# EasyEDA Pro project ProPrj_BrainStimulator-4Channels-Prototype_2025-12-16.epro, schematic Main

## Sheets
1 Main: Board Name: Board1; Create Date: 2025-11-07; Page Name: P1; Project Name: BrainStimulator-4Channels-Prototype; Schematic Name: Schematic1; Update Date: 2025-11-07; Company: 嘉立创EDA; Page Size: A4; Version: V1.0
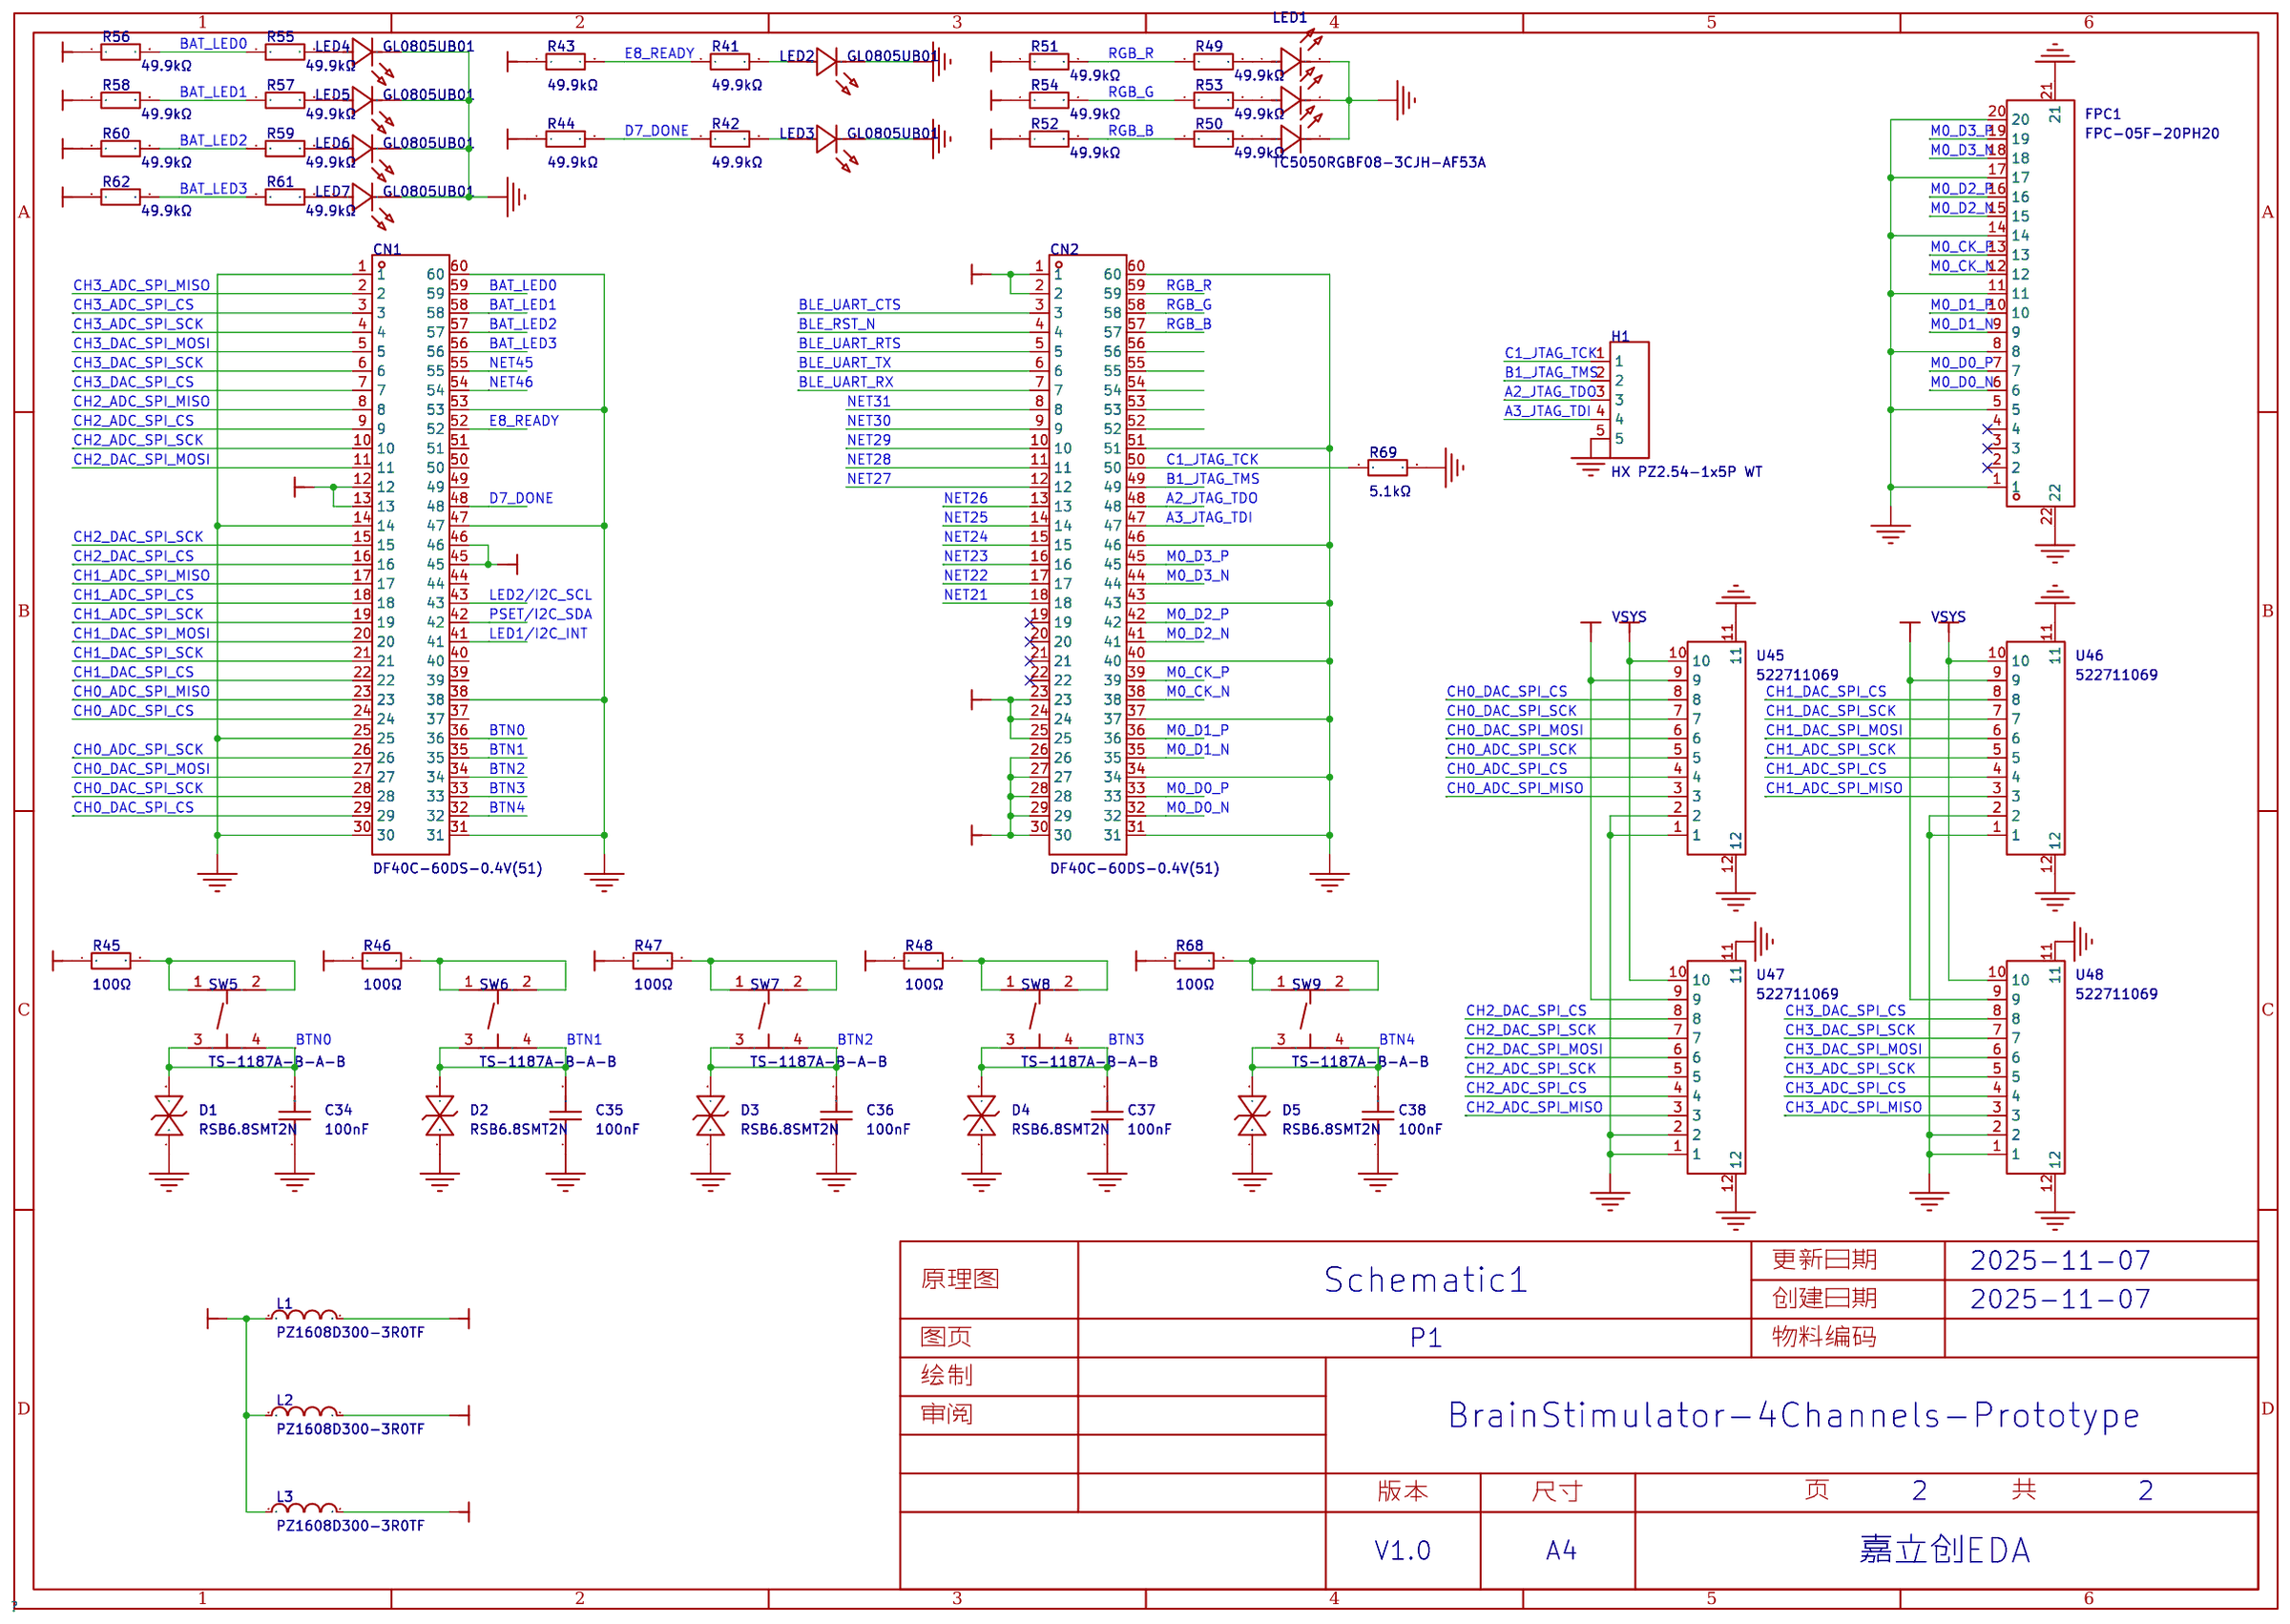
[diagram p2: Main]
2 Power
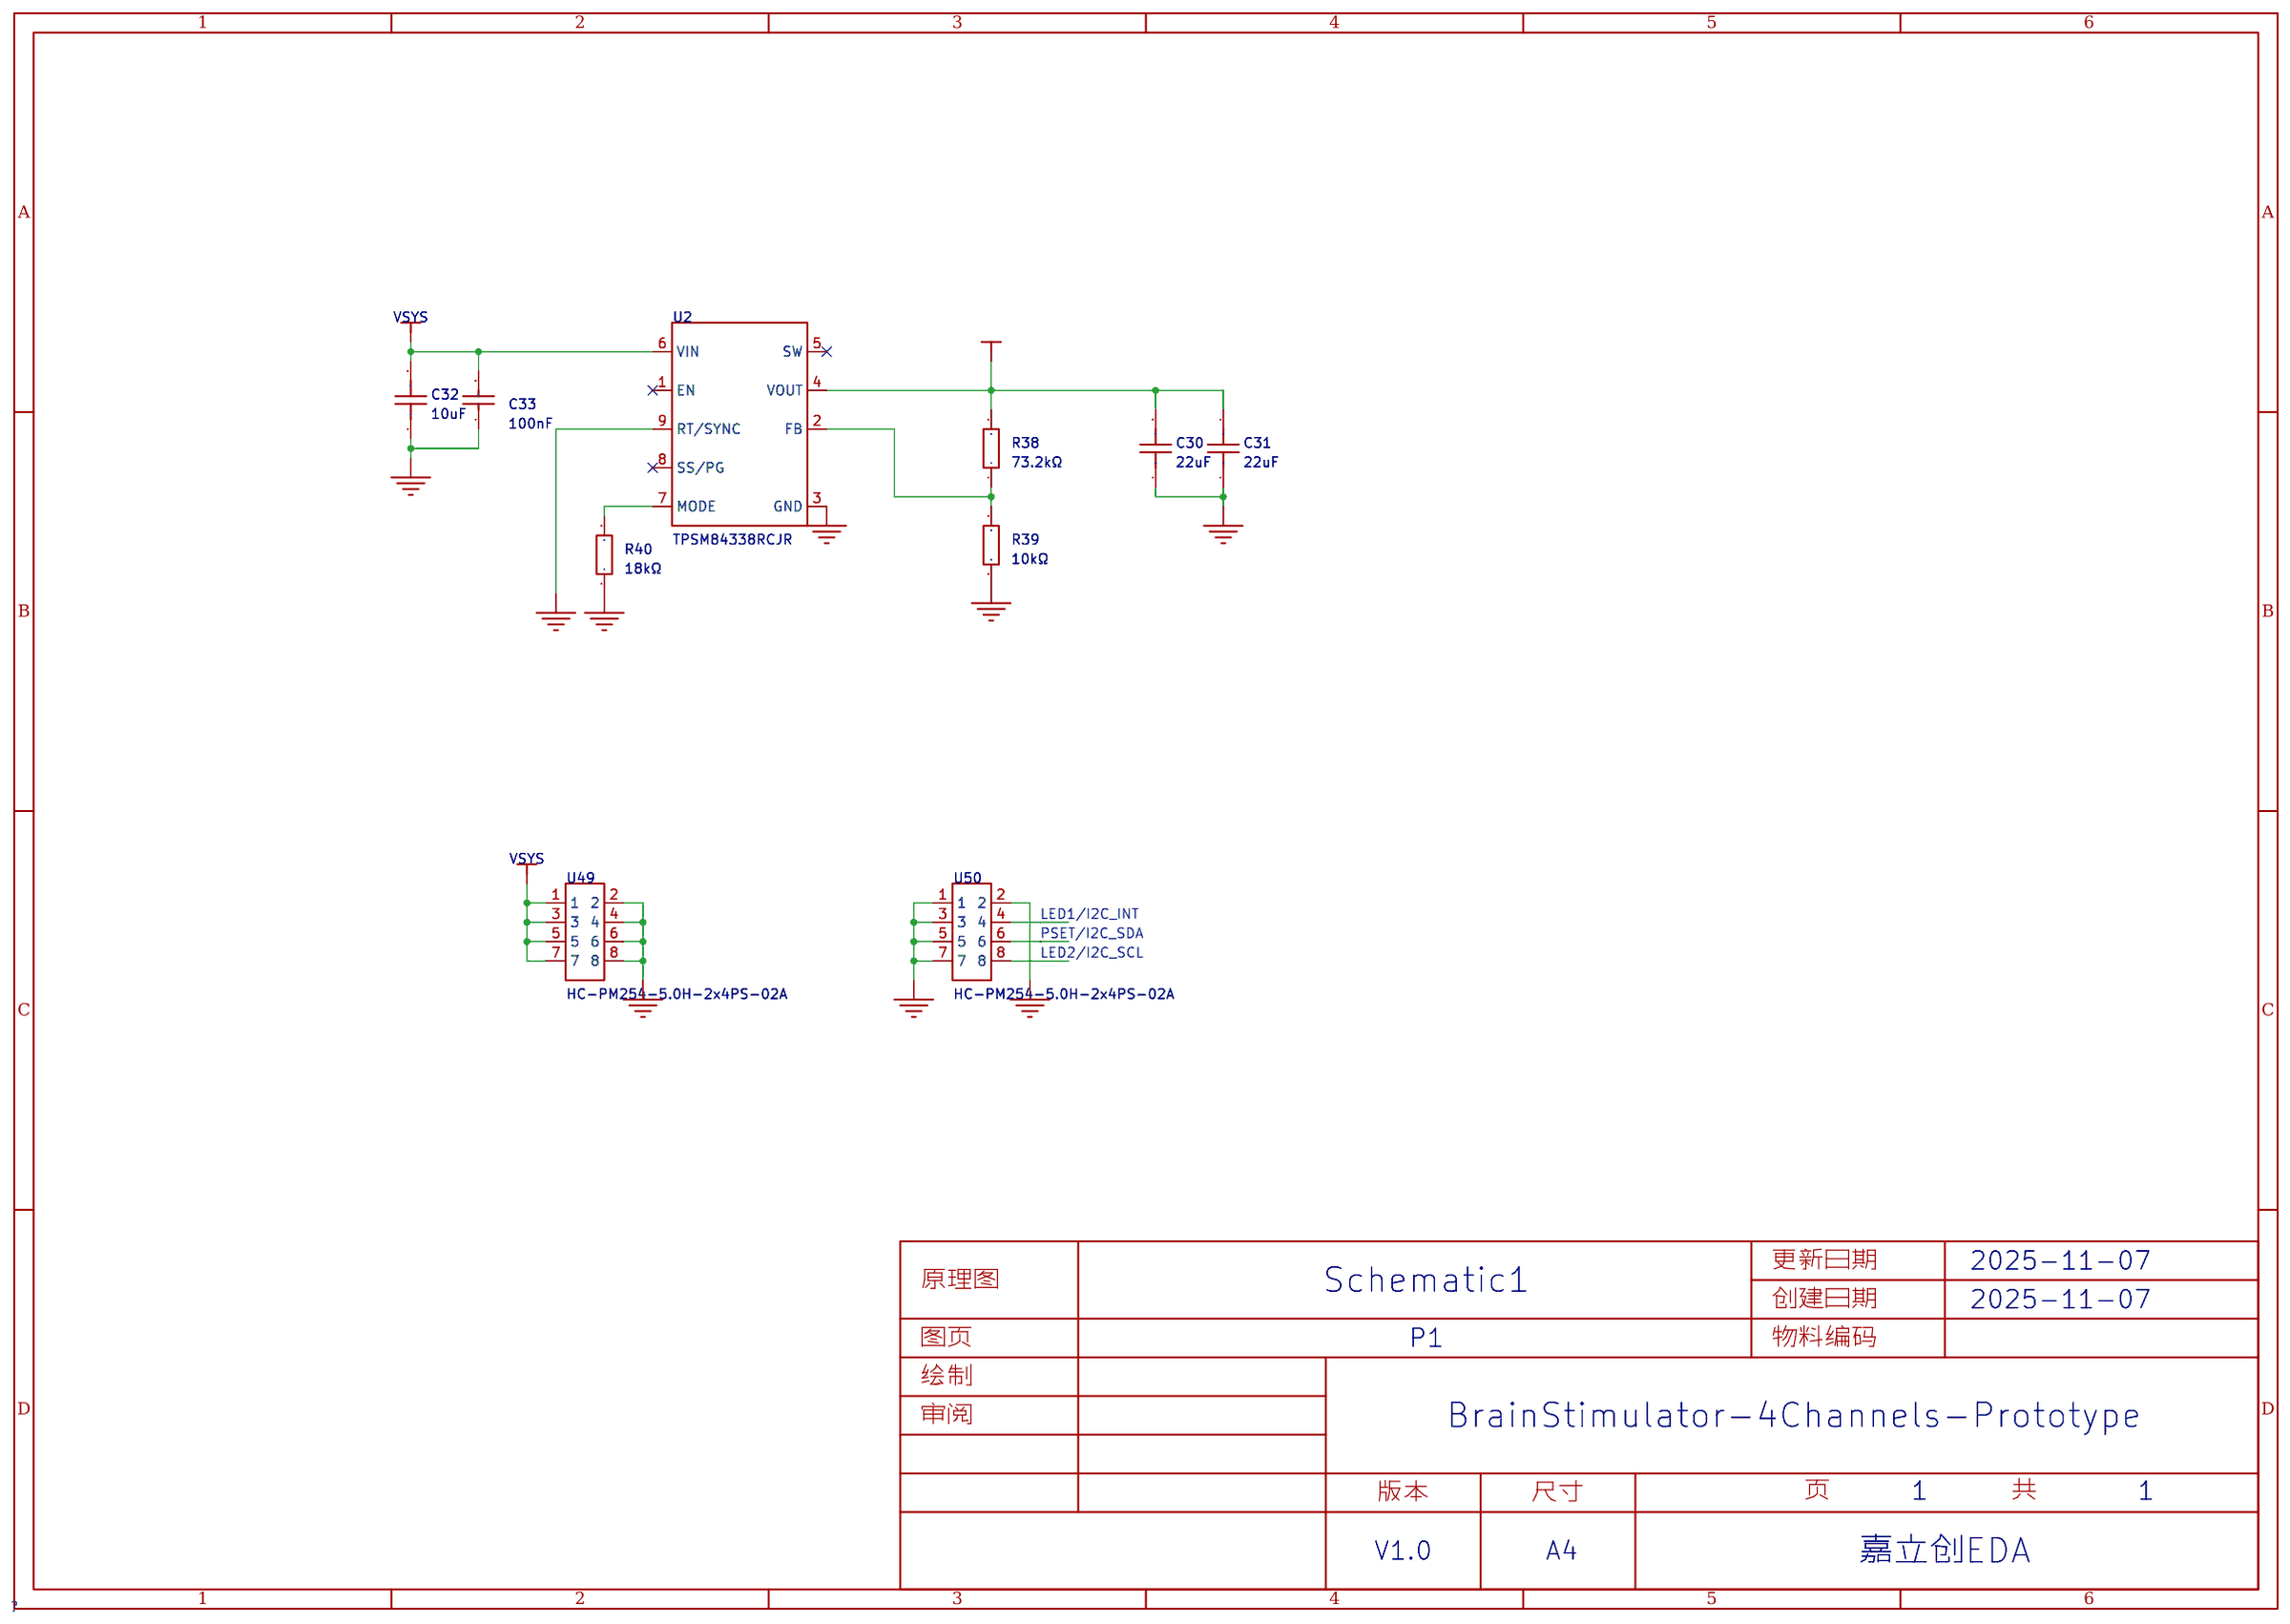
[diagram p3: Power]
3 Comm: Board Name: Cntrl Board; Create Date: 2025-11-16; Update Date: 2025-11-16
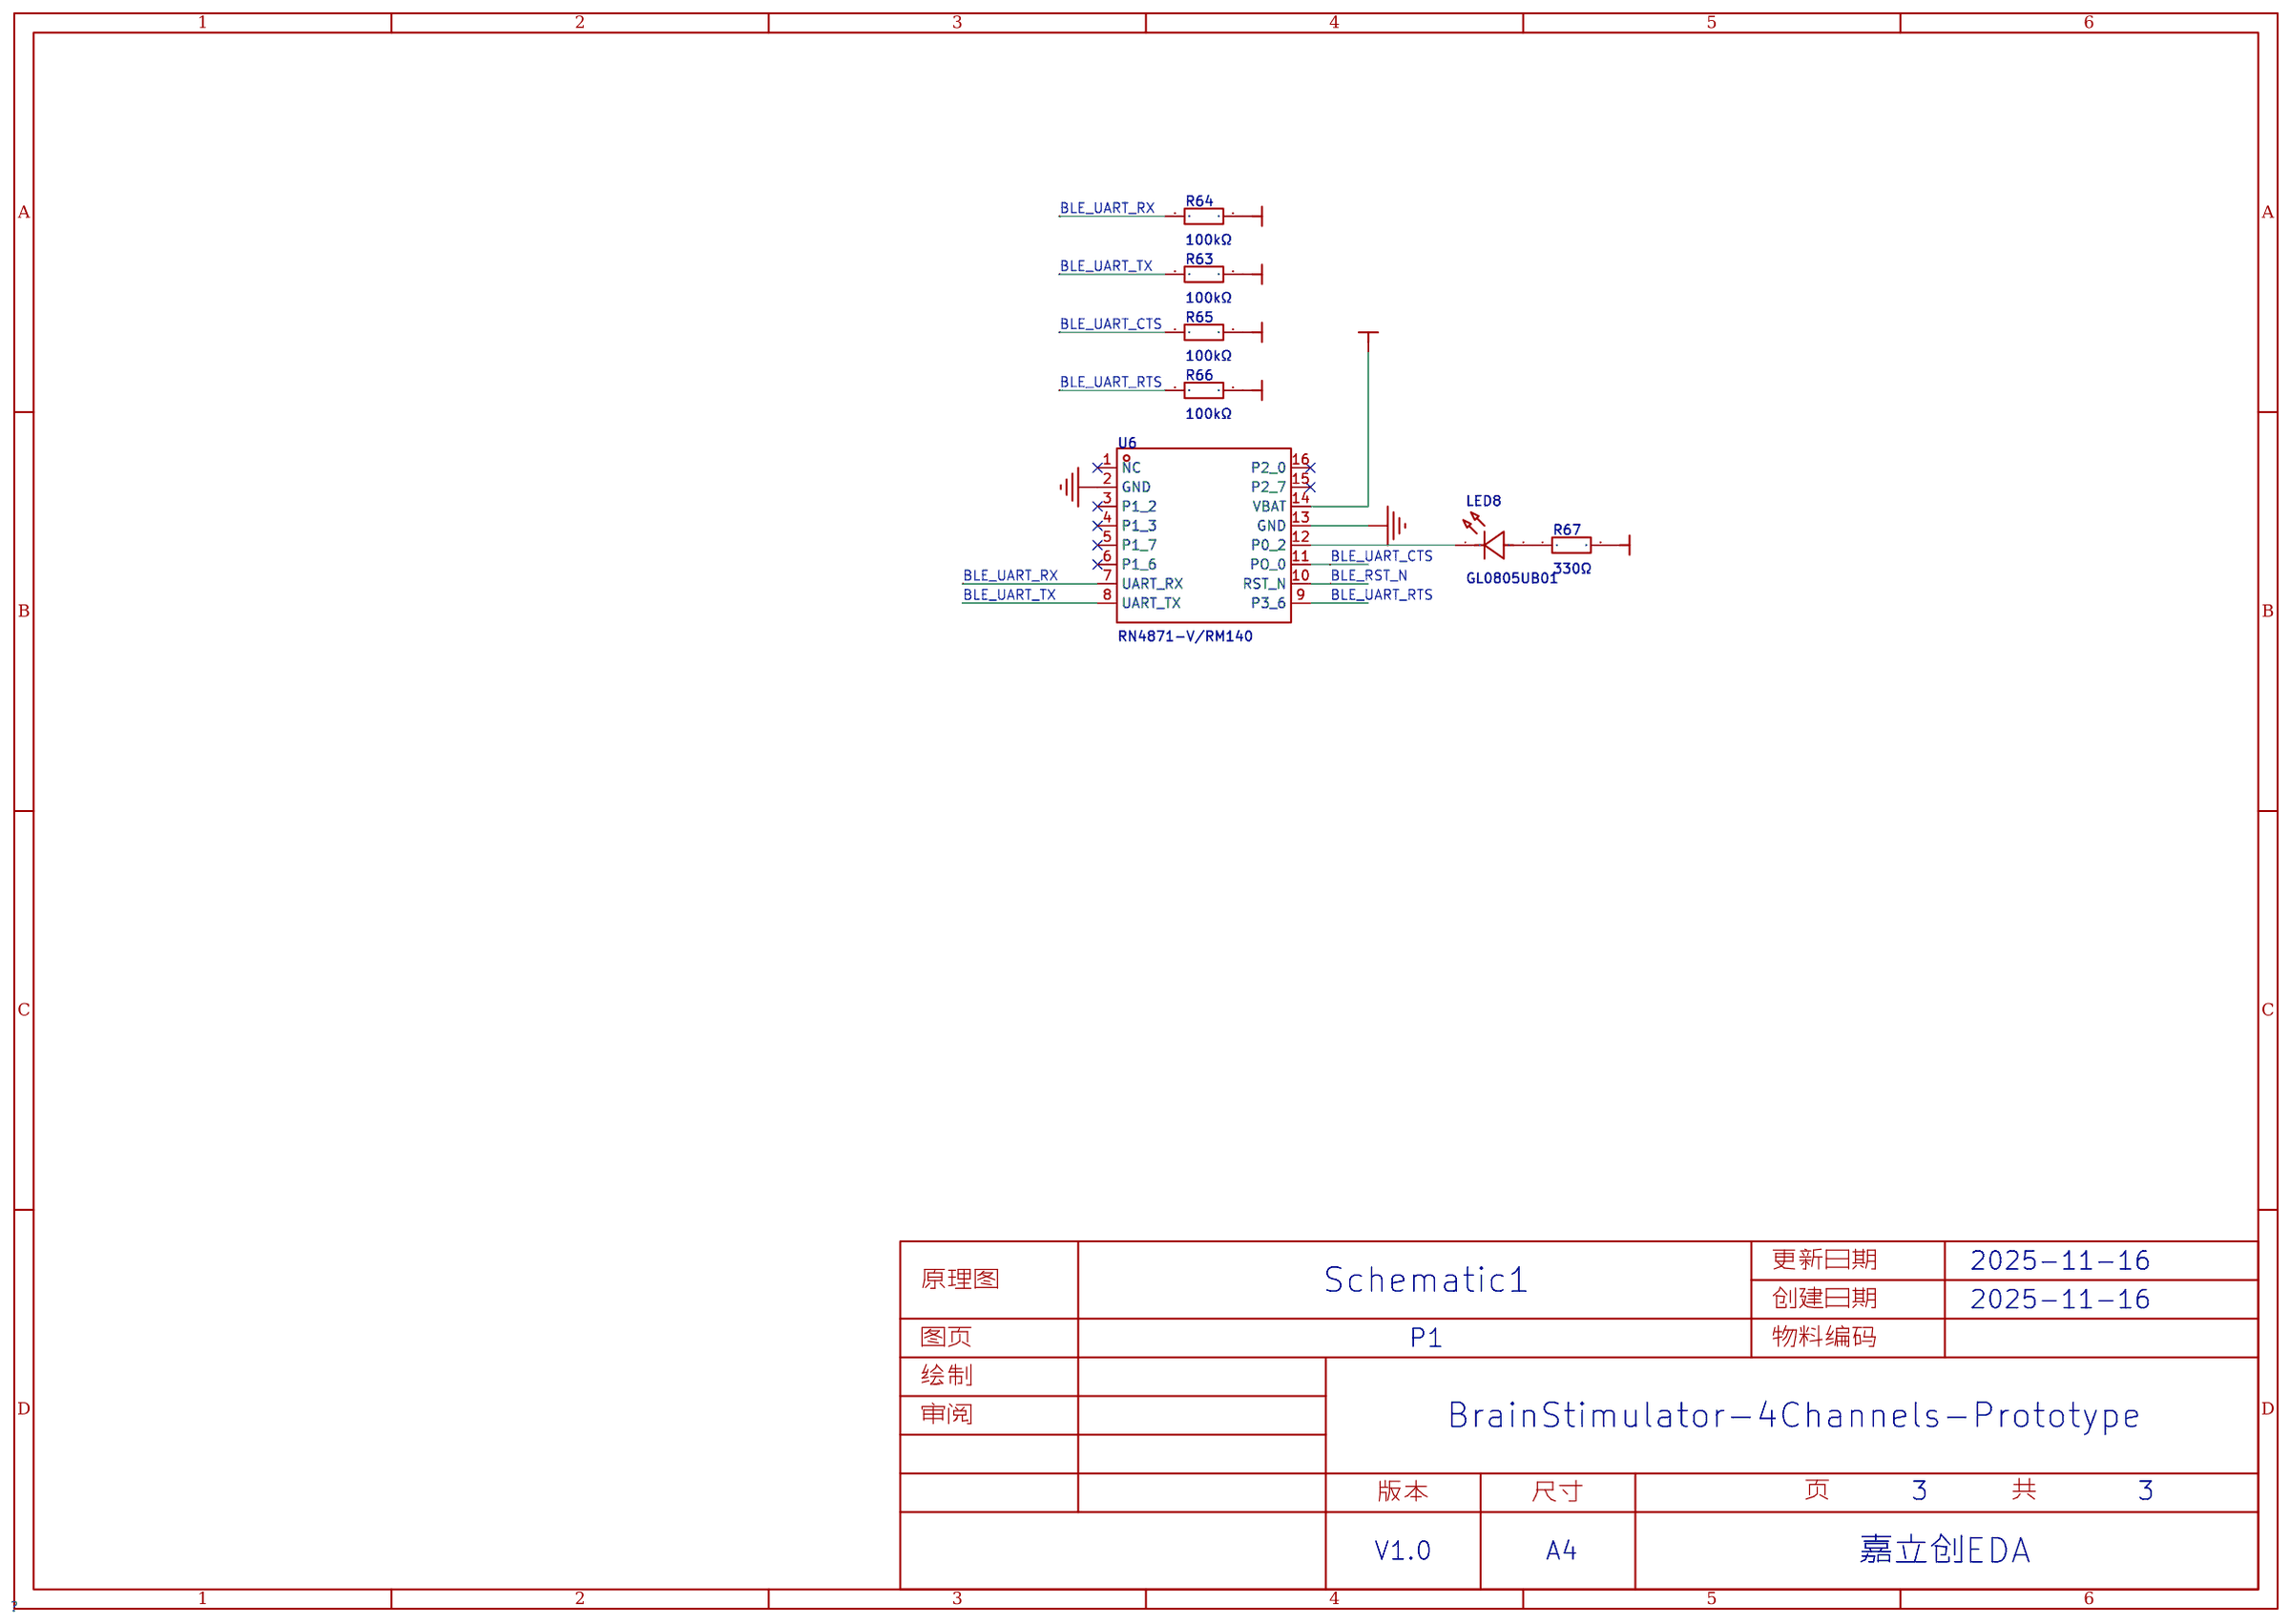
[diagram p4: Comm]

## Parts
sheet Comm
LED8  GL0805UB01  [LED0805-RD_BLUE]
R63  100kΩ  [R0603]
R64  100kΩ  [R0603]
R65  100kΩ  [R0603]
R66  100kΩ  [R0603]
R67  330Ω  [R0603]
U6  RN4871-V/RM140  [BULETM-SMD_RN4871-V-RM140]
sheet Main
C34  100nF  [C0603]
C35  100nF  [C0603]
C36  100nF  [C0603]
C37  100nF  [C0603]
C38  100nF  [C0603]
CN1  DF40C-60DS-0.4V(51)  [CONN-SMD_DF40C-60DS-0.4V-51]
CN2  DF40C-60DS-0.4V(51)  [CONN-SMD_DF40C-60DS-0.4V-51]
D1  RSB6.8SMT2N  [SOD-523_L1.2-W0.8-LS1.6-BI]
D2  RSB6.8SMT2N  [SOD-523_L1.2-W0.8-LS1.6-BI]
D3  RSB6.8SMT2N  [SOD-523_L1.2-W0.8-LS1.6-BI]
D4  RSB6.8SMT2N  [SOD-523_L1.2-W0.8-LS1.6-BI]
D5  RSB6.8SMT2N  [SOD-523_L1.2-W0.8-LS1.6-BI]
FPC1  FPC-05F-20PH20  [FPC-SMD_20P-P0.50_XUNPU_FPC-05F-20PH20]
H1  HX PZ2.54-1x5P WT  [HDR-SMD_5P-P2.54-H-M-W12.8-N]
L1  PZ1608D300-3R0TF  [L0603]
L2  PZ1608D300-3R0TF  [L0603]
L3  PZ1608D300-3R0TF  [L0603]
LED1  TC5050RGBF08-3CJH-AF53A  [LED-SMD_6P-L5.0-W5.0-TL_TC5050RGBF08]
LED2  GL0805UB01  [LED0805-RD_BLUE]
LED3  GL0805UB01  [LED0805-RD_BLUE]
LED4  GL0805UB01  [LED0805-RD_BLUE]
LED5  GL0805UB01  [LED0805-RD_BLUE]
LED6  GL0805UB01  [LED0805-RD_BLUE]
LED7  GL0805UB01  [LED0805-RD_BLUE]
R41  49.9kΩ  [R0603]
R42  49.9kΩ  [R0603]
R43  49.9kΩ  [R0603]
R44  49.9kΩ  [R0603]
R45  100Ω  [R0603]
R46  100Ω  [R0603]
R47  100Ω  [R0603]
R48  100Ω  [R0603]
R49  49.9kΩ  [R0603]
R50  49.9kΩ  [R0603]
R51  49.9kΩ  [R0603]
R52  49.9kΩ  [R0603]
R53  49.9kΩ  [R0603]
R54  49.9kΩ  [R0603]
R55  49.9kΩ  [R0603]
R56  49.9kΩ  [R0603]
R57  49.9kΩ  [R0603]
R58  49.9kΩ  [R0603]
R59  49.9kΩ  [R0603]
R60  49.9kΩ  [R0603]
R61  49.9kΩ  [R0603]
R62  49.9kΩ  [R0603]
R68  100Ω  [R0603]
R69  5.1kΩ  [R0603]
SW5  TS-1187A-B-A-B  [SW-SMD_4P-L5.1-W5.1-P3.70-LS6.5-TL_H1.5]
SW6  TS-1187A-B-A-B  [SW-SMD_4P-L5.1-W5.1-P3.70-LS6.5-TL_H1.5]
SW7  TS-1187A-B-A-B  [SW-SMD_4P-L5.1-W5.1-P3.70-LS6.5-TL_H1.5]
SW8  TS-1187A-B-A-B  [SW-SMD_4P-L5.1-W5.1-P3.70-LS6.5-TL_H1.5]
SW9  TS-1187A-B-A-B  [SW-SMD_4P-L5.1-W5.1-P3.70-LS6.5-TL_H1.5]
U45  522711069  [FPC-SMD_10P-P1.00_522711069]
U46  522711069  [FPC-SMD_10P-P1.00_522711069]
U47  522711069  [FPC-SMD_10P-P1.00_522711069]
U48  522711069  [FPC-SMD_10P-P1.00_522711069]
sheet Power
C30  22uF  [C0603]
C31  22uF  [C0603]
C32  10uF  [C0805]
C33  100nF  [C0805]
R38  73.2kΩ  [R0603]
R39  10kΩ  [R0603]
R40  18kΩ  [R0603]
U2  TPSM84338RCJR  [QFN-FCMOD-9_L4.5-W3.3_TPSM84338]
U49  HC-PM254-5.0H-2x4PS-02A  [HDR-SMD_8P-P2.54-V-F-R2-C4-S7.2-2]
U50  HC-PM254-5.0H-2x4PS-02A  [HDR-SMD_8P-P2.54-V-F-R2-C4-S7.2-2]

## Library data of the parts
LED2-LED8 = GL0805UB01: 0805 蓝灯 高亮; LCSC Part Name: 0805 蓝灯 高亮; Supplier Part: C51933309; Manufacturer: Guiguang light(桂光光电); Supplier Footprint: 0805; JLCPCB Part Class: Extended Part; Datasheet: https://item.szlcsc.com/datasheet/GL0805UB01/54646005.html; Supplier: LCSC
R63-R66 = RC0603FR-07100KL: 电阻类型:厚膜电阻;阻值:100kΩ;精度:±1%;功率:100mW;最大工作电压:75V;温度系数:±100ppm/℃;; LCSC Part Name: 厚膜电阻 100kΩ ±1% 100mW; Supplier Part: C14675; Manufacturer: YAGEO(国巨); Supplier Footprint: 0603; JLCPCB Part Class: Extended Part; Datasheet: https://atta.szlcsc.com/upload/public/pdf/source/20140324/1457707028752.pdf; Supplier: LCSC; Type: 厚膜电阻; Tolerance: ±1%; Power(Watts): 100mW; Overload Voltage (Max): 75V; Temperature Coefficient: ±100ppm/℃; Operating Temperature Range: -55℃~+155℃
R67 = RC0603FR-07330RL: 电阻类型:厚膜电阻;阻值:330Ω;精度:±1%;功率:100mW;最大工作电压:75V;温度系数:±100ppm/℃;; LCSC Part Name: 厚膜电阻 330Ω ±1% 100mW; Supplier Part: C105881; Manufacturer: YAGEO(国巨); Supplier Footprint: 0603; JLCPCB Part Class: Extended Part; Datasheet: https://atta.szlcsc.com/upload/public/pdf/source/20180821/C275644_0D56F95EFF785E7D9A1FEF436B37DA78.pdf; Supplier: LCSC; Type: 厚膜电阻; Tolerance: ±1%; Power(Watts): 100mW; Overload Voltage (Max): 75V; Temperature Coefficient: ±100ppm/℃; Operating Temperature Range: -55℃~+155℃
U6 = RN4871-V/RM140: 核心芯片:RN4871芯片;支持接口:I2C；AIO；UART；SPI；PWM；PIO;最大发射功率:0dBm;; Supplier Part: C1137511; Manufacturer: MICROCHIP(美国微芯); Supplier Footprint: SMD-16P; JLCPCB Part Class: Extended Part; Datasheet: https://atta.szlcsc.com/upload/public/pdf/source/20230907/0BE14DED8745D173EF6797ADB81DCDC8.pdf; Supplier: LCSC; Core  IC: RN4871芯片; Support Interface: I2C；AIO；UART；SPI；PWM；PIO; Output Power  (Max): 0dBm
C34-C38 = CC0603KRX7R9BB104: 容值:100nF;精度:±10%;额定电压:50V;温度系数:X7R;; LCSC Part Name: 100nF ±10% 50V; Supplier Part: C14663; Manufacturer: YAGEO(国巨); Supplier Footprint: 0603; JLCPCB Part Class: Basic Part; Datasheet: https://item.szlcsc.com/datasheet/CC0603KRX7R9BB104/15331.html; Supplier: LCSC; Tolerance: ±10%; Voltage Rating: 50V; Temperature Coefficient: X7R
CN1 CN2 = DF40C-60DS-0.4V(51): PIN总数:-;间距:0.4mm;安装方式:立贴;行数:2;额定电流:300mA;工作温度范围:-35℃~+85℃;; LCSC Part Name: 间距:0.4mm 母 立贴; Supplier Part: C597938; Manufacturer: HRS(广濑); Supplier Footprint: SMD,P=0.4mm; JLCPCB Part Class: Extended Part; Datasheet: https://atta.szlcsc.com/upload/public/pdf/source/20200611/C597932_F50447A8BD413549CB06DCD4A9C7496A.pdf; Supplier: LCSC; Pitch: 0.4mm; Mounting Style: 立贴; Number of Rows: 2; Current Rating (Max): 300mA; Contact Plating: 金; Operating Temperature Range: -35℃~+85℃
D1-D5 = RSB6.8SMT2N: 极性:双向;击穿电压:5.78V;; LCSC Part Name: 双向ESD; Supplier Part: C510343; Manufacturer: ROHM(罗姆); Supplier Footprint: SOD-523; JLCPCB Part Class: Extended Part; Datasheet: https://item.szlcsc.com/datasheet/RSB6.8SMT2N/524160.html; Supplier: LCSC; Polarity: 双向; Voltage - Breakdown: 5.78V; Reverse Leakage Current (Ir): 500nA; Number of Channels: 单路; Type: ESD; Junction Capacitance: 30pF
FPC1 = FPC-05F-20PH20: 锁定特性:翻盖式;触点类型:卧贴;触点数量:20P;间距:0.5mm;安装方式:下接;工作温度:-25℃~+85℃;; LCSC Part Name: 翻盖式 卧贴 P数:20P 间距:0.5mm; Supplier Part: C2856803; Manufacturer: XUNPU(讯普); Supplier Footprint: SMD,P=0.5mm,卧贴; JLCPCB Part Class: Extended Part; Datasheet: https://item.szlcsc.com/datasheet/FPC-05F-20PH20/3056901.html; Supplier: LCSC; Locking Feature: 翻盖式; Contact Type: 卧贴; Number of Contacts: 20P; Pitch: 0.5mm; Mounting Type: 下接; FFC, FCB Thickness: 0.3mm; Height Above Board: 2mm; Contact Material: 磷青铜; Contact Plating: 锡; Operating Temperature: -25℃~+85℃; Rated Voltage (Max): 50V; Current Rating (Max): 500mA
H1 = HX PZ2.54-1x5P WT: 插针结构:1x5P;间距:2.54mm;行距:-;圆针/方针:方针;安装方式:卧贴;排数:单排;总PIN位数:5P;额定电流:3A;额定电压:1kV;配合针长度:6mm;塑高:2.5mm;端接针长度:-;触头材质:黄铜;触头镀层:金;工作温度:-40℃~+105℃;颜色:黑色;; LCSC Part Name: 配套排母：HX PM2.54-1x5P系列 1x5P 间距:2.54mm 方针 卧贴; Supplier Part: C46061678; Manufacturer: hanxia(韩下); Supplier Footprint: SMD,P=2.54mm,卧贴; JLCPCB Part Class: Extended Part; Datasheet: https://item.szlcsc.com/datasheet/HX%2520PZ2.54-1x5P%2520WT/48170538.html; Supplier: LCSC; Pin Structure: 1x5P; Pitch: 2.54mm; Circluar Pins/Square Pins: 方针; Mounting Type: 卧贴; Number of Rows: 单排; Number of Pins: 5P; Current Rating: 3A; Voltage Rating (Max): 1kV; Length of Mating Pin: 6mm; Insulation Height: 2.5mm; Contact Material: 黄铜; Contact Plating: 金; Operating Temperature: -40℃~+105℃; Color: 黑色
L1-L3 = PZ1608D300-3R0TF: 阻抗 @ 频率:30Ω@100MHz;误差:±25%;直流电阻(DCR):30mΩ;; LCSC Part Name: 单路 0603磁珠 阻抗30Ω@100MHz; Supplier Part: C145059; Manufacturer: Sunlord(顺络); Supplier Footprint: 0603; JLCPCB Part Class: Extended Part; Datasheet: https://atta.szlcsc.com/upload/public/pdf/source/20241120/56CFDC78F74CEDC225A629A43232883A.pdf; Supplier: LCSC; Impedance @ Frequency: 30Ω@100MHz; Tolerance: ±25%; DC Resistance: 30mΩ; Current Rating: 3A; Circuits: 1
LED1 = TC5050RGBF08-3CJH-AF53A: 5050RGB，0.2W 20mA; LCSC Part Name: RGB三色; Supplier Part: C784540; Manufacturer: TCWIN(天成); Supplier Footprint: SMD5050-6P; JLCPCB Part Class: Extended Part; Datasheet: https://item.szlcsc.com/datasheet/TC5050RGBF08-3CJH-AF53A/839886.html; Supplier: LCSC; Operating Temperature: -40℃~+85℃
R41-R44 R49-R62 = RC0603FR-0749K9L: 电阻类型:厚膜电阻;阻值:49.9kΩ;精度:±1%;功率:100mW;工作电压:75V;温度系数:±100ppm/℃;; LCSC Part Name: 厚膜电阻 49.9kΩ ±1% 100mW; Supplier Part: C114624; Manufacturer: YAGEO(国巨); Supplier Footprint: 0603; JLCPCB Part Class: Extended Part; Datasheet: https://item.szlcsc.com/datasheet/RC0603FR-0749K9L/115868.html; Supplier: LCSC; Type: 厚膜电阻; Tolerance: ±1%; Power(Watts): 100mW; Voltage-Supply(Max): 75V; Temperature Coefficient: ±100ppm/℃; Operating Temperature: -55℃~+155℃
R45-R48 R68 = RC0603FR-07100RL: 电阻类型:厚膜电阻;阻值:100Ω;精度:±1%;功率:100mW;最大工作电压:75V;温度系数:±100ppm/℃;; LCSC Part Name: 厚膜电阻 100Ω ±1% 100mW; Supplier Part: C105588; Manufacturer: YAGEO(国巨); Supplier Footprint: 0603; JLCPCB Part Class: Extended Part; Datasheet: https://atta.szlcsc.com/upload/public/pdf/source/20180316/70C0E2BDAE7FCC62C531A5A58D202EE1.pdf; Supplier: LCSC; Type: 厚膜电阻; Tolerance: ±1%; Power(Watts): 100mW; Overload Voltage (Max): 75V; Temperature Coefficient: ±100ppm/℃; Operating Temperature Range: -55℃~+155℃
R69 = RC0603FR-075K1L: 电阻类型:厚膜电阻;阻值:5.1kΩ;精度:±1%;功率:100mW;工作电压:75V;温度系数:±100ppm/℃;; LCSC Part Name: 厚膜电阻 5.1kΩ ±1% 100mW; Supplier Part: C105580; Manufacturer: YAGEO(国巨); Supplier Footprint: 0603; JLCPCB Part Class: Extended Part; Datasheet: https://item.szlcsc.com/datasheet/RC0603FR-075K1L/106795.html; Supplier: LCSC; Type: 厚膜电阻; Tolerance: ±1%; Power(Watts): 100mW; Voltage-Supply(Max): 75V; Temperature Coefficient: ±100ppm/℃; Operating Temperature: -55℃~+155℃
SW5-SW9 = TS-1187A-B-A-B: 电路结构:单刀单掷;按钮形状:圆形按钮;作用力:1.6N;安装方式:立贴;开关长度:5.1mm;开关宽度:5.1mm;开关高度:1.5mm;带支架:不带支架;触点电流:50mA;额定电压:12V;带灯:无;工作寿命:10万次;; LCSC Part Name: 5.1*5.1*1.5mm 立贴 轻触开关; Supplier Part: C318884; Manufacturer: XKB Connection(中国星坤); Supplier Footprint: SMD; JLCPCB Part Class: Basic Part; Datasheet: https://item.szlcsc.com/datasheet/TS-1187A-B-A-B/299976.html; Supplier: LCSC; Circuit: 单刀单掷; Actuator Style: 圆形按钮; Operating Force: 1.6N; Mounting Type: 立贴; Length: 5.1mm; Width: 5.1mm; Switch Height: 1.5mm; with Bracket: 不带支架; Contact Current: 50mA; Voltage Rating: 12V; Actuator/Cap Color: 金色; With Lamp: 无; Life: 10万次; Operating Temperature: -30℃~+85℃
U45-U48 = 522711069: 触点类型:下接;触点数量:10P;间距:1mm;工作温度:-40℃~+85℃;; LCSC Part Name: 下接 P数:10P 间距:1mm; Supplier Part: C588180; Manufacturer: MOLEX; Supplier Footprint: SMD,P=1mm; JLCPCB Part Class: Extended Part; Datasheet: https://www.molex.com/content/dam/molex/molex-dot-com/products/automated/en-us/salesdrawingpdf/522/52271/522711069_sd.pdf?inline\; Supplier: LCSC; Contact Type: 下接; Number of Contacts: 10P; Pitch: 1mm; Contact Material: 磷青铜; Contact Plating: 金; Operating Temperature: -40℃~+85℃; Rated Voltage (Max): 50V; Current Rating (Max): 500mA
C30 C31 = CL10A226MP8NUNE: 容值:22uF;精度:±20%;额定电压:10V;温度系数:X5R;; LCSC Part Name: 22uF ±20% 10V; Supplier Part: C86295; Manufacturer: SAMSUNG(三星); Supplier Footprint: 0603; JLCPCB Part Class: Extended Part; Datasheet: https://item.szlcsc.com/datasheet/CL10A226MP8NUNE/87471.html; Supplier: LCSC; Tolerance: ±20%; Voltage Rating: 10V; Temperature Coefficient: X5R
C32 = GRM21BR61H106KE43L: 容值:10uF;精度:±10%;额定电压:50V;温度系数:X5R;; LCSC Part Name: 10uF ±10% 50V; Supplier Part: C440198; Manufacturer: muRata(村田); Supplier Footprint: 0805; JLCPCB Part Class: Basic Part; Datasheet: https://item.szlcsc.com/datasheet/GRM21BR61H106KE43L/439567.html; Supplier: LCSC; Tolerance: ±10%; Voltage Rating: 50V; Temperature Coefficient: X5R
C33 = CL21B104KBCNNNC: 容值:100nF;精度:±10%;额定电压:50V;温度系数:X7R;; LCSC Part Name: 100nF ±10% 50V; Supplier Part: C1711; Manufacturer: SAMSUNG(三星); Supplier Footprint: 0805; JLCPCB Part Class: Extended Part; Datasheet: https://item.szlcsc.com/datasheet/CL21B104KBCNNNC/2063.html; Supplier: LCSC; Tolerance: ±10%; Voltage Rating: 50V; Temperature Coefficient: X7R
R38 = RC0603FR-0773K2L: 电阻类型:厚膜电阻;阻值:73.2kΩ;精度:±1%;功率:100mW;最大工作电压:75V;温度系数:±100ppm/℃;; LCSC Part Name: 厚膜电阻 73.2kΩ ±1% 100mW; Supplier Part: C163420; Manufacturer: YAGEO(国巨); Supplier Footprint: 0603; JLCPCB Part Class: Extended Part; Datasheet: https://atta.szlcsc.com/upload/public/pdf/source/20181009/C309620_DA5935B6E1D48212CB7A533FE518B3C2.pdf; Supplier: LCSC; Type: 厚膜电阻; Tolerance: ±1%; Power(Watts): 100mW; Overload Voltage (Max): 75V; Temperature Coefficient: ±100ppm/℃; Operating Temperature Range: -55℃~+155℃
R39 = RC0603FR-0710KL: 电阻类型:厚膜电阻;阻值:10kΩ;精度:±1%;功率:100mW;最大工作电压:75V;温度系数:±100ppm/℃;; LCSC Part Name: 厚膜电阻 10kΩ ±1% 100mW; Supplier Part: C98220; Manufacturer: YAGEO(国巨); Supplier Footprint: 0603; JLCPCB Part Class: Extended Part; Datasheet: https://atta.szlcsc.com/upload/public/pdf/source/20180927/C295883_E8D83085EA81BD7DE0B2B681138C15EE.pdf; Supplier: LCSC; Type: 厚膜电阻; Tolerance: ±1%; Power(Watts): 100mW; Overload Voltage (Max): 75V; Temperature Coefficient: ±100ppm/℃; Operating Temperature Range: -55℃~+155℃
R40 = RC0603FR-0718KL: 电阻类型:厚膜电阻;阻值:18kΩ;精度:±1%;功率:100mW;工作电压:75V;温度系数:±100ppm/℃;; LCSC Part Name: 厚膜电阻 18kΩ ±1% 100mW; Supplier Part: C114610; Manufacturer: YAGEO(国巨); Supplier Footprint: 0603; JLCPCB Part Class: Extended Part; Datasheet: https://item.szlcsc.com/datasheet/RC0603FR-0718KL/115854.html; Supplier: LCSC; Type: 厚膜电阻; Tolerance: ±1%; Power(Watts): 100mW; Voltage-Supply(Max): 75V; Temperature Coefficient: ±100ppm/℃; Operating Temperature: -55℃~+155℃
U2 = TPSM84338RCJR_C47122151: 是一种高效、高电压输入、易于使用的同步降压电源模块，具有高度的设计灵活性。其工作输入电压范围为3.8V至28V，适用于由5V、12V、19V、24V电源总线轨供电的系统。该设备支持高达3A的连续输出电流和98%的最大占空比。使用带内部补偿的固定频率峰值电流控制，以实现快速瞬态响应和良好的线路及负载调节; Supplier Part: C47122151; Manufacturer: TI(德州仪器); Supplier Footprint: QFN-FCMOD-9; JLCPCB Part Class: Extended Part; Datasheet: https://www.ti.com.cn/cn/lit/ds/symlink/tpsm84338.pdf; Supplier: LCSC
U49 U50 = HC-PM254-5.0H-2x4PS-02A: 插孔结构:2x4P;间距:2.54mm;行距:2.54mm;圆孔/方孔:方孔;安装方式:立贴;排数:双排;总孔位数:8P;额定电流:3A;额定电压:-;插孔方向:顶部;塑高:5mm;触头材质:黄铜;触头镀层:金;工作温度:-40℃~+105℃;; LCSC Part Name: 间距2.54mm 2x4Pin 立贴 PW7.4 H5.0; Supplier Part: C42163132; Manufacturer: HC(虹成电子); Supplier Footprint: SMD,P=2.54mm; JLCPCB Part Class: Extended Part; Datasheet: https://item.szlcsc.com/datasheet/HC-PM254-5.0H-2x4PS-02A/44033121.html; Supplier: LCSC; Holes Structure: 2x4P; Pitch: 2.54mm; Row Spacing: 2.54mm; Circular Hole / Square Hole: 方孔; Mounting Type: 立贴; Number of Rows: 双排; Number of Positions: 8P; Current Rating: 3A; Holes Direction: 顶部; Insulation Height: 5mm; Contact Material: 黄铜; Contact Plating: 金; Operating Temperature: -40℃~+105℃

## Nets
3V3: CN2.23 CN2.24 CN2.25 L1.1 L2.1 L3.1 R43.1 R44.1 R45.1 R46.1 R47.1 R48.1 R51.1 R52.1 R54.1 R56.1 R58.1 R60.1 R62.1 R63.1 R64.1 R65.1 R66.1 R67.2 R68.1 U6.14(VBAT) U45.9 U46.9 U47.9 U48.9
+5V: C30.2 C31.2 CN2.26 CN2.27 CN2.28 CN2.29 CN2.30 R38.2 U2.4(VOUT)
GND: C30.1 C31.1 C32.1 C33.1 C34.1 C35.1 C36.1 C37.1 C38.1 CN1.1 CN1.14 CN1.25 CN1.30 CN1.31 CN1.38 CN1.47 CN1.53 CN1.60 CN2.31 CN2.34 CN2.37 CN2.40 CN2.43 CN2.46 CN2.51 CN2.60 D1.1(C) D2.1(C) D3.1(C) D4.1(C) D5.1(C) FPC1.1 FPC1.5 FPC1.8 FPC1.11 FPC1.14 FPC1.17 FPC1.20 FPC1.21 FPC1.22 H1.5 LED1.4(-) LED1.5(-) LED1.6(-) LED2.1(K) LED3.1(K) LED4.1(K) LED5.1(K) LED6.1(K) LED7.1(K) R39.1 R40.1 R69.2 U2.3(GND) U2.9(RT/SYNC) U6.2(GND) U6.13(GND) U45.1 U45.2 U45.11 U45.12 U46.1 U46.2 U46.11 U46.12 U47.1 U47.2 U47.11 U47.12 U48.1 U48.2 U48.11 U48.12 U49.2 U49.4 U49.6 U49.8 U50.1 U50.2 U50.3 U50.5 U50.7
A2_JTAG_TDO: CN2.48 H1.3
A3_JTAG_TDI: CN2.47 H1.4
B1_JTAG_TMS: CN2.49 H1.2
BAT_LED0: CN1.59 R55.1 R56.2
BAT_LED1: CN1.58 R57.1 R58.2
BAT_LED2: CN1.57 R59.1 R60.2
BAT_LED3: CN1.56 R61.1 R62.2
BLE_RST_N: CN2.4 U6.10(RST_N)
BLE_UART_CTS: CN2.3 R65.2 U6.11(PO_0)
BLE_UART_RTS: CN2.5 R66.2 U6.9(P3_6)
BLE_UART_RX: CN2.7 R64.2 U6.7(UART_RX)
BLE_UART_TX: CN2.6 R63.2 U6.8(UART_TX)
BTN0: C34.2 CN1.36 D1.2(A) SW5.3(C) SW5.4(D)
BTN1: C35.2 CN1.35 D2.2(A) SW6.3(C) SW6.4(D)
BTN2: C36.2 CN1.34 D3.2(A) SW7.3(C) SW7.4(D)
BTN3: C37.2 CN1.33 D4.2(A) SW8.3(C) SW8.4(D)
BTN4: C38.2 CN1.32 D5.2(A) SW9.3(C) SW9.4(D)
C1_JTAG_TCK: CN2.50 H1.1 R69.1
CH0_ADC_SPI_CS: CN1.24 U45.4
CH0_ADC_SPI_MISO: CN1.23 U45.3
CH0_ADC_SPI_SCK: CN1.26 U45.5
CH0_DAC_SPI_CS: CN1.29 U45.8
CH0_DAC_SPI_MOSI: CN1.27 U45.6
CH0_DAC_SPI_SCK: CN1.28 U45.7
CH1_ADC_SPI_CS: CN1.18 U46.4
CH1_ADC_SPI_MISO: CN1.17 U46.3
CH1_ADC_SPI_SCK: CN1.19 U46.5
CH1_DAC_SPI_CS: CN1.22 U46.8
CH1_DAC_SPI_MOSI: CN1.20 U46.6
CH1_DAC_SPI_SCK: CN1.21 U46.7
CH2_ADC_SPI_CS: CN1.9 U47.4
CH2_ADC_SPI_MISO: CN1.8 U47.3
CH2_ADC_SPI_SCK: CN1.10 U47.5
CH2_DAC_SPI_CS: CN1.16 U47.8
CH2_DAC_SPI_MOSI: CN1.11 U47.6
CH2_DAC_SPI_SCK: CN1.15 U47.7
CH3_ADC_SPI_CS: CN1.3 U48.4
CH3_ADC_SPI_MISO: CN1.2 U48.3
CH3_ADC_SPI_SCK: CN1.4 U48.5
CH3_DAC_SPI_CS: CN1.7 U48.8
CH3_DAC_SPI_MOSI: CN1.5 U48.6
CH3_DAC_SPI_SCK: CN1.6 U48.7
D7_DONE: CN1.48 R42.1 R44.2
E8_READY: CN1.52 R41.1 R43.2
LED1/I2C_INT: CN1.41 U50.4
LED2/I2C_SCL: CN1.43 U50.8
M0_CK_N: CN2.38 FPC1.12
M0_CK_P: CN2.39 FPC1.13
M0_D0_N: CN2.32 FPC1.6
M0_D0_P: CN2.33 FPC1.7
M0_D1_N: CN2.35 FPC1.9
M0_D1_P: CN2.36 FPC1.10
M0_D2_N: CN2.41 FPC1.15
M0_D2_P: CN2.42 FPC1.16
M0_D3_N: CN2.44 FPC1.18
M0_D3_P: CN2.45 FPC1.19
NET21: CN2.18
NET22: CN2.17
NET23: CN2.16
NET24: CN2.15
NET25: CN2.14
NET26: CN2.13
NET27: CN2.12
NET28: CN2.11
NET29: CN2.10
NET30: CN2.9
NET31: CN2.8
NET45: CN1.55
NET46: CN1.54
PSET/I2C_SDA: CN1.42 U50.6
RGB_B: CN2.57 R50.1 R52.2
RGB_G: CN2.58 R53.1 R54.2
RGB_R: CN2.59 R49.1 R51.2
VCCIO0/1: CN1.12 CN1.13 L1.2
VCCIO2/3: CN2.1 CN2.2 L2.2
VCCIO6/7: CN1.45 CN1.46 L3.2
VSYS: C32.2 C33.2 U2.6(VIN) U45.10 U46.10 U47.10 U48.10 U49.1 U49.3 U49.5 U49.7
$1N5: R40.2 U2.7(MODE)
$1N10: R38.1 R39.2 U2.2(FB)
$2N63: LED2.2(A) R41.2
$2N64: LED3.2(A) R42.2
$2N74: R45.2 SW5.1(A) SW5.2(B)
$2N77: R46.2 SW6.1(A) SW6.2(B)
$2N82: R47.2 SW7.1(A) SW7.2(B)
$2N87: R48.2 SW8.1(A) SW8.2(B)
$2N174: LED1.3(+) R50.2
$2N175: LED1.1(+) R49.2
$2N176: LED1.2(+) R53.2
$2N180: LED4.2(A) R55.2
$2N183: LED5.2(A) R57.2
$2N186: LED6.2(A) R59.2
$2N189: LED7.2(A) R61.2
$2N202: R68.2 SW9.1(A) SW9.2(B)
$9N14: LED8.1(K) U6.12(P0_2)
$9N15: LED8.2(A) R67.1

Not connected (* = marked no-connect by the designer): CN1 37 39 40 44 49 50 51; CN2 19* 20* 21* 22* 52 53 54 55 56; FPC1 2* 3* 4*; U2 1(EN)* 5(SW)* 8(SS/PG)*; U6 1(NC)* 3(P1_2)* 4(P1_3)* 5(P1_7)* 6(P1)* 15(P2_7)* 16(P2_0)*
